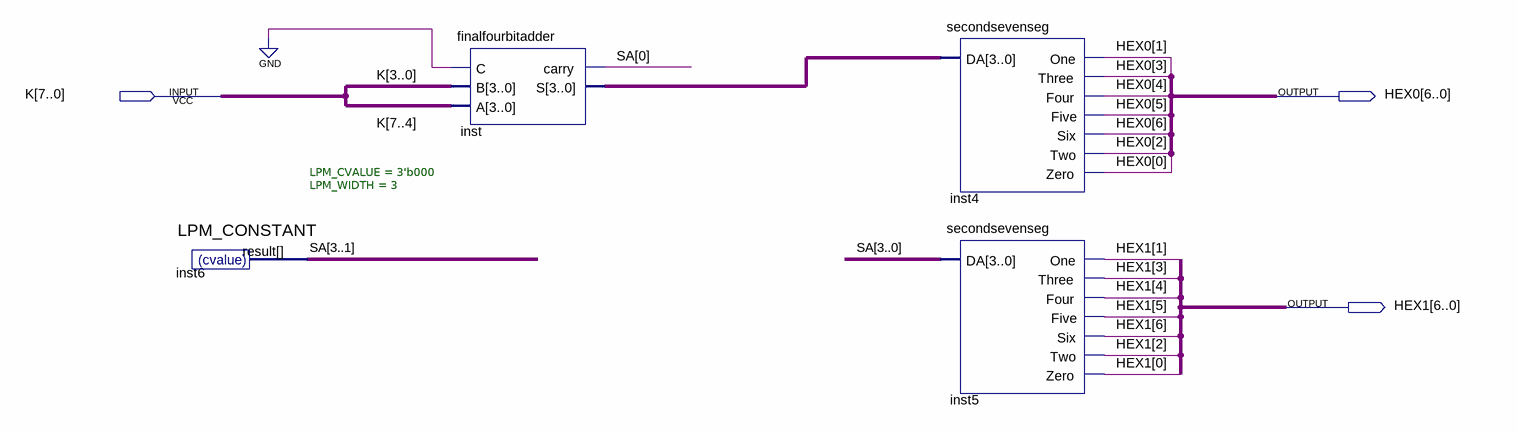
[diagram p0: schematic sheet]
// Quartus schematic fourbitaddersevenseg.bdf as structural Verilog: 4 symbols, 3 pins
module fourbitaddersevenseg (
  input  [7:0] K,
  output [6:0] HEX0,
  output [6:0] HEX1
);

  wire [3:0] inst_s, SA;

  LPM_CONSTANT #(.LPM_CVALUE(3'b000), .LPM_WIDTH(3)) inst6 (.result(SA[3:1]));
  finalfourbitadder inst (.C(1'b0), .B(K[3:0]), .A(K[7:4]), .carry(SA[0]), .S(inst_s));
  secondsevenseg inst4 (
    .DA(inst_s), .One(HEX0[1]), .Three(HEX0[3]), .Four(HEX0[4]), .Five(HEX0[5]), .Six(HEX0[6]),
    .Two(HEX0[2]), .Zero(HEX0[0]));
  secondsevenseg inst5 (
    .DA(SA), .One(HEX1[1]), .Three(HEX1[3]), .Four(HEX1[4]), .Five(HEX1[5]), .Six(HEX1[6]), .Two(HEX1[2]),
    .Zero(HEX1[0]));
endmodule
